# EAGLE design USBSocket_Type7_v1.0 (EAGLE 9.6.2)
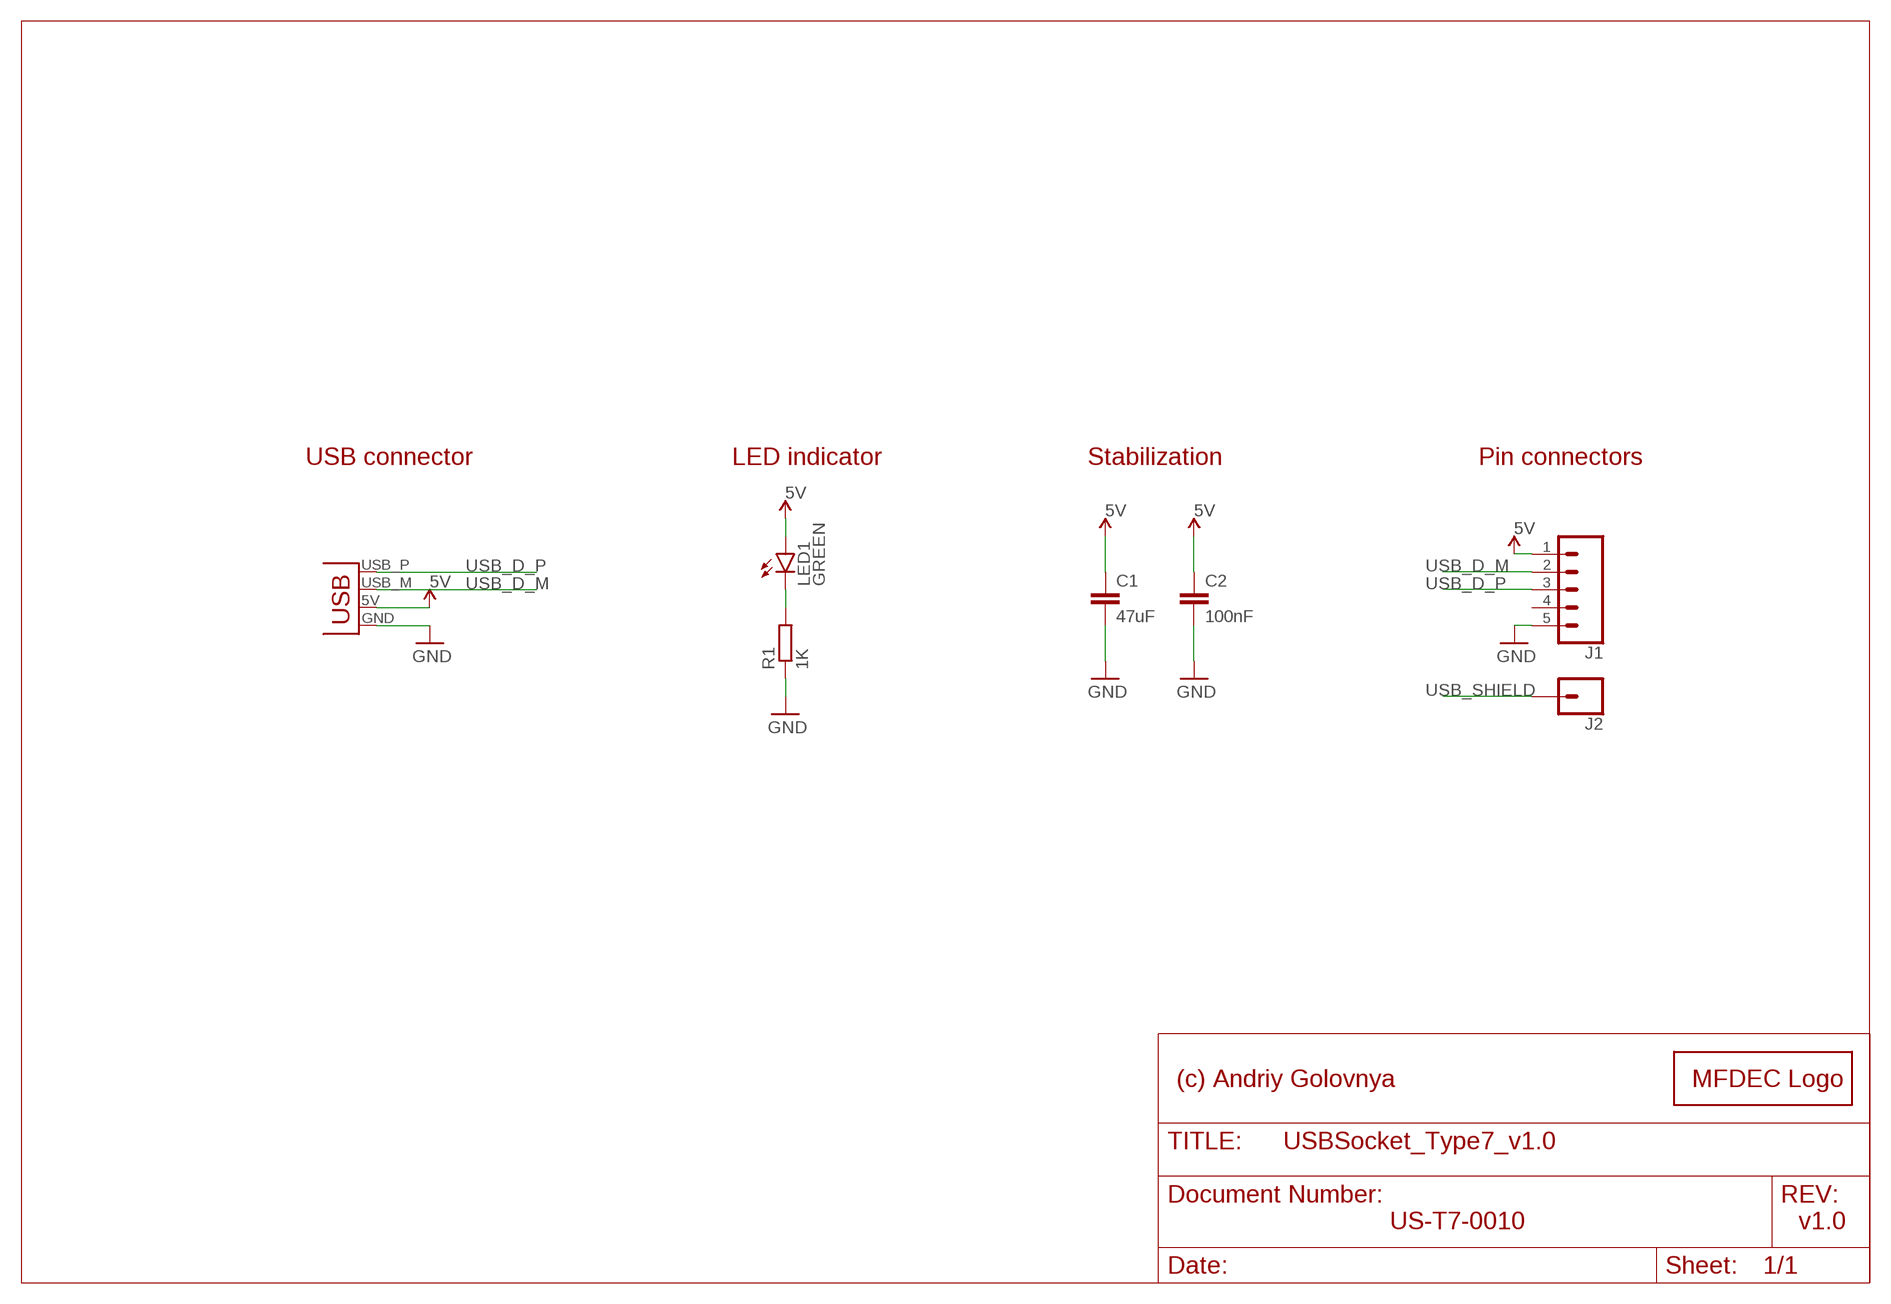
[diagram p0: schematic, sheet 1]

## Parts
C1  47uF  C-EUC0805  [C0805]
C2  100nF  C-EUC0402  [C0402]
J1  CONN_05PTH  [1X05]
J2  CONN_01  [1X01]
LED1  GREEN  LEDSML0603  [SML0603]
LOGO1  MFDECLOGO_L_10MM  [MFDEC_L_10MM]
R1  1K  R-EU_R0402  [R0402]
X1  USBPCB  [USB-A-PCB]

## Nets
5V [POWER]: C1.1 C2.1 J1.1 LED1.A X1.5V(VBUS)
GND [POWER]: C1.2 C2.2 J1.5 R1.1 X1.GND
N$7: LED1.C R1.2
USB_D_M [XUSB]: J1.2 X1.USB_M(D-)
USB_D_P [XUSB]: J1.3 X1.USB_P(D+)
USB_SHIELD: J2.1
Unconnected: J1.4

## Notes on the sheet
- USB connector | LED indicator | Stabilization | Pin connectors
- (c) Andriy Golovnya
- US-T7-0010 | v1.0

## Library data of the parts
C1 C2 = rcl:C-EU: CAPACITOR, European symbol; SPICEPREFIX: C
J1 = _my_locked_connectors:CONN_05: Multi connection point. Often used as Generic Header-pin footprint for 0.1 inch spaced/style header connections On any of the 0.1 inch spaced packages, you can populate with these: Break Away Headers - Straight <https://www.sparkfun.com/products/116> (PRT-00116) Break Away Male Headers - Right Angle <https://www.sparkfun.com/products/553> (PRT-00553) Female Headers <https://www.sparkfun.com/products/115> (PRT-00115) Break Away Headers - Machine Pin <https://www.sparkfun.com/products/117> (PRT-00117) Break Away Female Headers - Swiss Machine Pin <https://www.sparkfun.com/products/743> (PRT-00743) For SCREWTERMINALS and SPRING TERMINALS visit here: Screw Terimnals on SparkFun.com <https://www.sparkfun.com/search/results?term=Screw+Terminals> (5mm/3.5mm/2.54mm spacing) This device is also useful as a general connection point to wire up your design to another part of your project. Our various solder wires solder well into these plated through hole pads. Hook-Up Wire - Assortment (Stranded, 22 AWG) <https://www.sparkfun.com/products/11375> (PRT-11375) Hook-Up Wire - Assortment (Solid Core, 22 AWG) <https://www.sparkfun.com/products/11367> (PRT-11367) View the entire wire category on our website here <https://www.sparkfun.com/categories/141> Special notes: Molex polarized connector foot print use with SKU : PRT-08231 with associated crimp pins and housings. 1MM SMD Version SKU: PRT-10208
J2 = SparkFun-Connectors:CONN_01: Single connection point. Often used as Generic Header-pin footprint for 0.1 inch spaced/style header connections On any of the 0.1 inch spaced packages, you can populate with these: Break Away Headers - Straight <https://www.sparkfun.com/products/116> (PRT-00116) Break Away Male Headers - Right Angle <https://www.sparkfun.com/products/553> (PRT-00553) Female Headers <https://www.sparkfun.com/products/115> (PRT-00115) Break Away Headers - Machine Pin <https://www.sparkfun.com/products/117> (PRT-00117) Break Away Female Headers - Swiss Machine Pin <https://www.sparkfun.com/products/743> (PRT-00743) This device is also useful as a general connection point to wire up your design to another part of your project. Our various solder wires solder well into these plated through hole pads. Hook-Up Wire - Assortment (Stranded, 22 AWG) <https://www.sparkfun.com/products/11375> (PRT-11375) Hook-Up Wire - Assortment (Solid Core, 22 AWG) <https://www.sparkfun.com/products/11367> (PRT-11367) View the entire wire category on our website here <https://www.sparkfun.com/categories/141> Special notes: SMTSO-256-ET is a "flush mount" nut for a 4-40 screw. We mostly use this on specialty testbeds; it is a nice way to connect hardware to your PCB at an adjustable hieght. Also note, the SNAP packages are for using a snappable style connector. We sell a baggie of snaps and they are also used on two LilyPad designs: Snap Assortment - 30 pack (male and female) <https://www.sparkfun.com/products/11347> (DEV-11347) LilyPad Arduino SimpleSnap <https://www.sparkfun.com/products/10941> (DEV-10941) LilyPad SimpleSnap Protoboard <https://www.sparkfun.com/products/10940> (DEV-10940)
LED1 = led:LED: LED OSRAM: - CHIPLED LG R971, LG N971, LY N971, LG Q971, LY Q971, LO R971, LY R971 LH N974, LH R974 LS Q976, LO Q976, LY Q976 LO Q996 - Hyper CHIPLED LW Q18S LB Q993, LB Q99A, LB R99A - SideLED LS A670, LO A670, LY A670, LG A670, LP A670 LB A673, LV A673, LT A673, LW A673 LH A674 LY A675 LS A676, LA A676, LO A676, LY A676, LW A676 LS A679, LY A679, LG A679 - Hyper Micro SIDELED® LS Y876, LA Y876, LO Y876, LY Y876 LT Y87S - SmartLED LW L88C, LW L88S LB L89C, LB L89S, LG L890 LS L89K, LO L89K, LY L89K LS L896, LA L896, LO L896, LY L896 - TOPLED LS T670, LO T670, LY T670, LG T670, LP T670 LSG T670, LSP T670, LSY T670, LOP T670, LYG T670 LG T671, LOG T671, LSG T671 LB T673, LV T673, LT T673, LW T673 LH T674 LS T676, LA T676, LO T676, LY T676, LB T676, LH T676, LSB T676, LW T676 LB T67C, LV T67C, LT T67C, LS T67K, LO T67K, LY T67K, LW E67C LS E67B, LA E67B, LO E67B, LY E67B, LB E67C, LV E67C, LT E67C LW T67C LS T679, LY T679, LG T679 LS T770, LO T770, LY T770, LG T770, LP T770 LB T773, LV T773, LT T773, LW T773 LH T774 LS E675, LA E675, LY E675, LS T675 LS T776, LA T776, LO T776, LY T776, LB T776 LHGB T686 LT T68C, LB T68C - Hyper Mini TOPLED® LB M676 - Mini TOPLED Santana® LG M470 LS M47K, LO M47K, LY M47K Source: http://www.osram.convergy.de LUXEON: - LUMILED® LXK2-PW12-R00, LXK2-PW12-S00, LXK2-PW14-U00, LXK2-PW14-V00 LXK2-PM12-R00, LXK2-PM12-S00, LXK2-PM14-U00 LXK2-PE12-Q00, LXK2-PE12-R00, LXK2-PE12-S00, LXK2-PE14-T00, LXK2-PE14-U00 LXK2-PB12-K00, LXK2-PB12-L00, LXK2-PB12-M00, LXK2-PB14-N00, LXK2-PB14-P00, LXK2-PB14-Q00 LXK2-PR12-L00, LXK2-PR12-M00, LXK2-PR14-Q00, LXK2-PR14-R00 LXK2-PD12-Q00, LXK2-PD12-R00, LXK2-PD12-S00 LXK2-PH12-R00, LXK2-PH12-S00 LXK2-PL12-P00, LXK2-PL12-Q00, LXK2-PL12-R00 Source: www.luxeon.com KINGBRIGHT: KA-3528ASYC Source: www.kingbright.com
LOGO1 = _my_logos:MFDECLOGO: Midnight Fog - Digital Eye Candy LOGO
R1 = rcl:R-EU_: RESISTOR, European symbol; SPICEPREFIX: R
X1 = SparkFun:USB: USB Connectors USB-B-PTH is fully proven SKU : PRT-00139 USB-miniB is fully proven SKU : PRT-00587 USB-A-PCB is untested. USB-A-H is throughly reviewed, but untested. Spark Fun Electronics SKU : PRT-00437 USB-B-SMT is throughly reviewed, but untested. Needs silkscreen touching up. USB-A-S has not been used/tested USB-MB-H has not been used/tested

## Net classes
1 XUSB: width 0.305 mm
2 USB: width 0.305 mm
3 POWER: width 0.305 mm

## Board
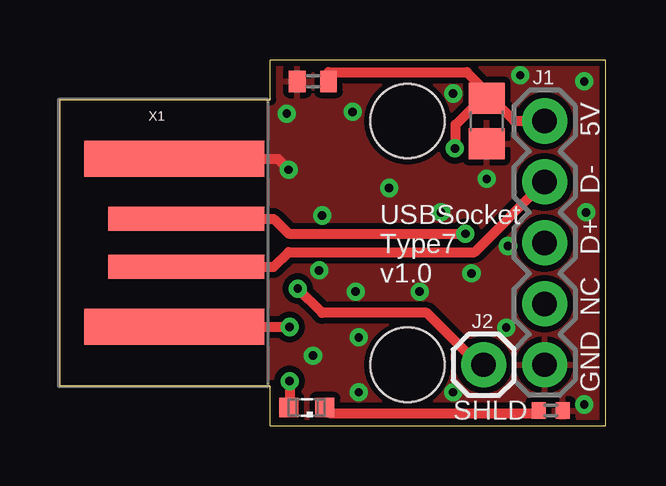
[diagram p1: board, top side]
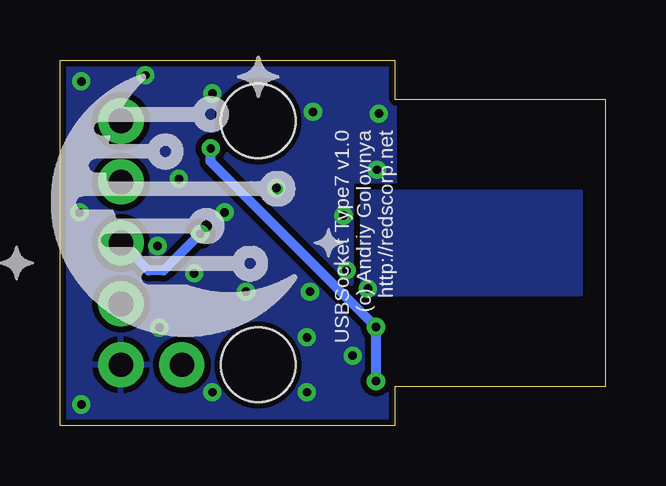
[diagram p2: board, bottom side, seen from below]

Size 22.73 x 15.24 mm. Coordinates in mm from the lower left corner, seen from the top.
Outline: 8.76,0 22.73,0 22.73,15.24 8.76,15.24 8.76,13.59 0,13.59 0,1.65 8.76,1.65 8.76,0
Copper layers (1*16): Top 0.035mm / dielectric 1.5mm / Bottom 0.035mm
Design rules "default *": minimum track width 6mil, minimum drill 0.35mm, track to track 6mil, track to pad 6mil, pad to pad 6mil, via to via 6mil, smd to smd 6mil, copper to edge 10mil, drill to drill 6mil, minimum pad ring 10mil, minimum via ring 8mil, stop-mask expansion 4mil, vias tented up to drill 20mil, thermal gap 10mil
Holes 3.1 mm at 14.48,2.54 14.48,12.7

### Footprints (pad centres in the part's own frame; a part is rotated, then mirrored left to right if it is on the bottom)
C0805 = smd 1.3 x 1.5: 1 -0.95,0; 2 0.95,0
C0402 = smd 0.7 x 0.9: 1 -0.65,0; 2 0.65,0
1X05 = drill 1.016 pad 1.88: 1 0,0; 2 2.54,0; 3 5.08,0; 4 7.62,0; 5 10.16,0
1X01 = drill 1.016 pad 1.88: 1 0,0
SML0603 = smd 0.8 x 0.8: A 0.75,0; C -0.75,0
R0402 = smd 0.6 x 0.7: 1 -0.5,0; 2 0.5,0
USB-A-PCB = smd 7.5 x 1.5: 5V -0.2,-3.5; GND -0.2,3.5 | smd 6.5 x 1: USB_M 0.3,-1; USB_P 0.3,1

### Placement (x,y rotation side)
C1  17.78,12.7 270 top
C2  10.54,14.35 180 top
J1  20.19,12.7 270 top
J2  17.65,2.54 0 top
LED1  10.29,0.76 180 top
LOGO1  26.04,2.79 0 bottom  (outside the outline)
R1  20.45,0.64 180 top
X1  4.95,7.62 0 top

### Tracks (layer width: path | path; a pad name or v marks a point on that pad's centre or on a via)
5V  (via drill 0.35)
  Top 0.406: C1.1 17.59,13.65 16.48,12.55 16.48,11.62 16.44,11.57 v16.45,11.56 | C2.1 11.19,14.73 16.95,14.73 17.78,13.9 C1.1 | C1.1 17.97,13.65 18.92,12.7 J1.1 | v9.57,1.86 9.57,0.79 LED1.A | X1.5V v9.57,4.12
  Bottom 0.406: v9.57,1.86 v9.57,4.12 16.45,11 v16.45,11.56
GND  (via drill 0.35)
  Top 0.406: X1.GND 9.07,11.12 v9.53,10.67
  other vias: 18.59,4.09 21.84,0.89 21.84,14.35 21.92,8.89 12.19,13.08 17.78,10.29 9.45,13 16.38,13.84 19.18,14.61 12.32,5.59 12.45,3.68 12.45,1.4 16.38,1.4 17.14,6.35 10.54,2.92 13.72,9.91 15.88,8.89 18.67,7.49 10.79,6.48 10.92,8.76 14.99,5.59
  pour Top (isolate 0.254, rank 2): 8.76,0 28.83,0 28.83,15.24 8.76,15.24
  pour Bottom (isolate 0.254, rank 2): 8.76,0 25.65,0 25.65,15.24 8.76,15.24
N$7
  Top 0.406: R1.2 19.82,0.51 11.29,0.51 LED1.C
USB_D_M
  Top 0.406: X1.USB_M 8.91,6.62 9.53,7.24 17.27,7.24 J1.2
USB_D_P  (via drill 0.35)
  Top 0.406: X1.USB_P 8.91,8.62 9.53,8 v16.89,8
  Bottom 0.406: J1.3 19.05,6.48 18.41,6.48 v16.89,8
USB_SHIELD  (via drill 0.35)
  Top 0.406: J2.1 17.44,2.54 15.29,4.7 10.92,4.7 v9.91,5.71
  pour Bottom: 10.16,5.46 1.02,5.46 1.02,9.78 10.16,9.78 10.16,5.59

### Text on the board
tPlace: 5V | D- | D+ | USBSocket / Type7 / v1.0 | NC | GND | SHLD
bPlace: USBSocket Type7 v1.0 / (c) Andriy Golovnya / http://redscorp.net